# Altium project BW1097_R2M2E3.PrjPcb (part 4 of 10)

## Sheet BW1097_HUB.SchDoc: =project_title
size Tabloid; PageSetup: Record=PageOptions|CenterHorizontal=True|CenterVertical=True|PrintScale=0.73|XCorrection=1.00|YCorrection=1.00|PrintKind=0|BorderSize=5000000|LeftOffset=0|BottomOffset=0|Orientation=2|PaperLength=1000|PaperWidth=1000|Scale=100|PaperSource=7|PrintQuality=-4|MediaType=1|DitherType=10|PaperKind=A4|PrintScaleMode=1; CompanyName: Luxonis Holding; DrawnBy: Brian Weinstein; Organization: Luxonis Holding; Address1: 1925 Harmony Park Drive; Address2: Westminster, CO; Address3: 80234; Address4: United States; DocumentNumber: D0000196; Revision: R2M2E3; SheetNumber: 8; SheetTotal: 17
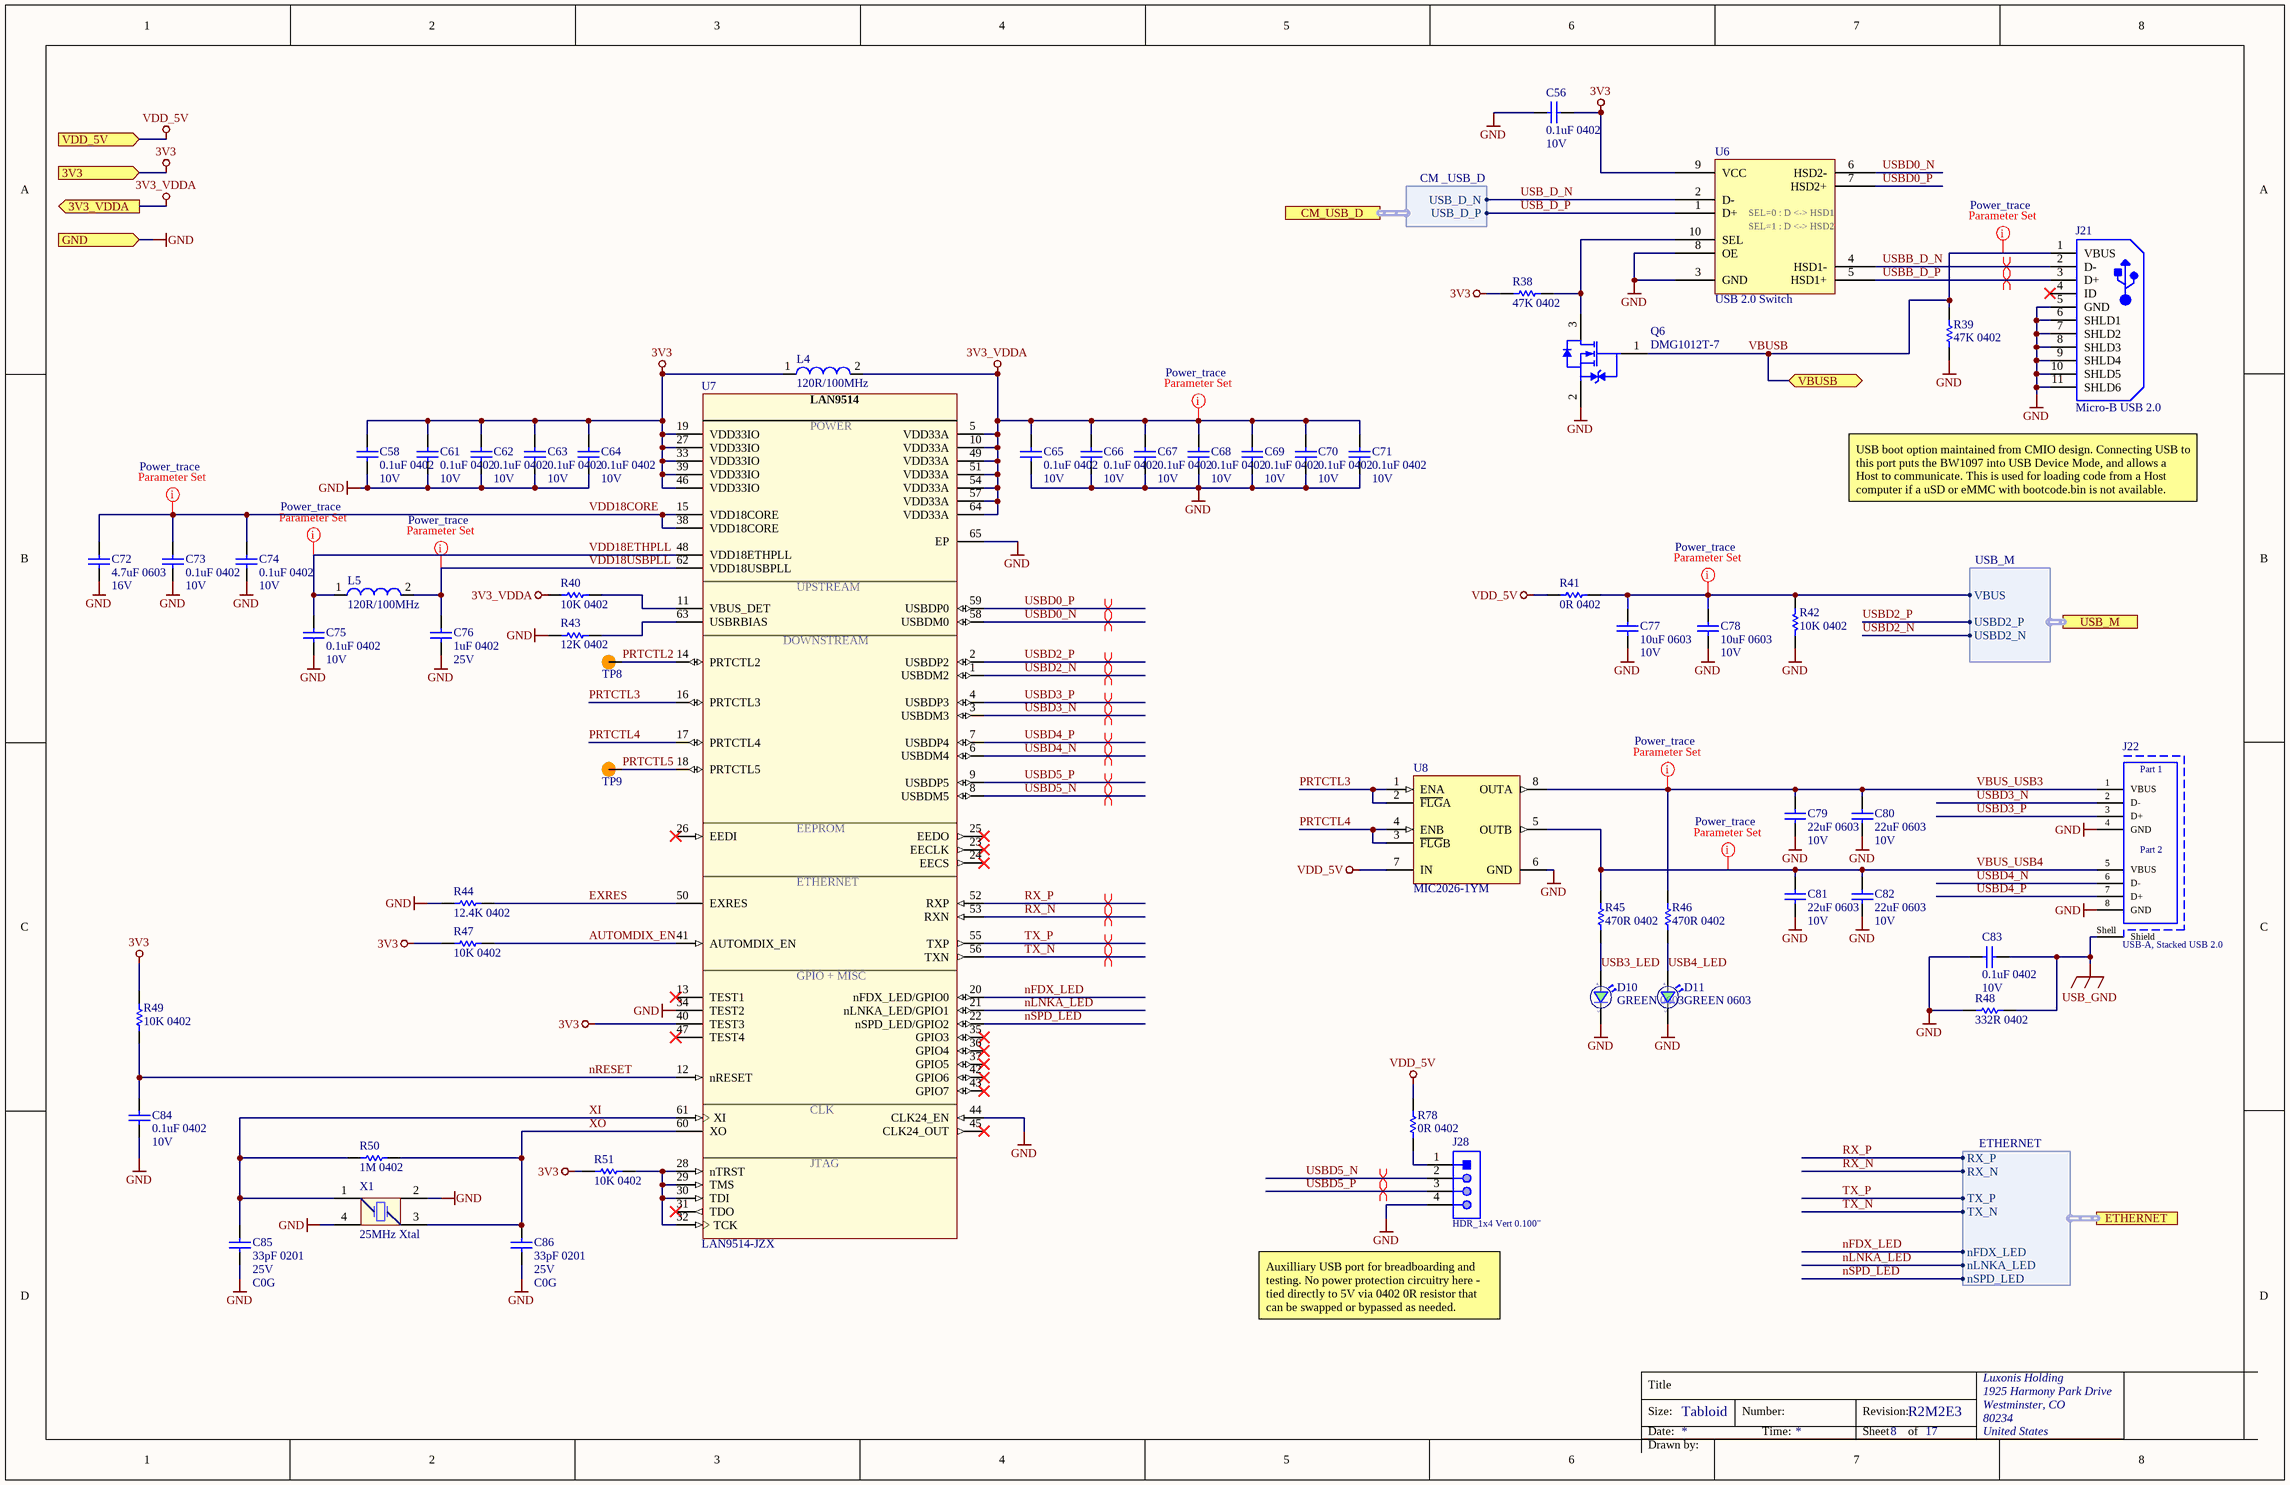
[diagram p6: BW1097_HUB.SchDoc]

### Parts
C56  0.1uF 0402  Voltage Rating: 10V  [CAPC0402(1005)70_N]
C58  0.1uF 0402  Voltage Rating: 10V  [CAPC0402(1005)70_N]
C61  0.1uF 0402  Voltage Rating: 10V  [CAPC0402(1005)70_N]
C62  0.1uF 0402  Voltage Rating: 10V  [CAPC0402(1005)70_N]
C63  0.1uF 0402  Voltage Rating: 10V  [CAPC0402(1005)70_N]
C64  0.1uF 0402  Voltage Rating: 10V  [CAPC0402(1005)70_N]
C65  0.1uF 0402  Voltage Rating: 10V  [CAPC0402(1005)70_N]
C66  0.1uF 0402  Voltage Rating: 10V  [CAPC0402(1005)70_N]
C67  0.1uF 0402  Voltage Rating: 10V  [CAPC0402(1005)70_N]
C68  0.1uF 0402  Voltage Rating: 10V  [CAPC0402(1005)70_N]
C69  0.1uF 0402  Voltage Rating: 10V  [CAPC0402(1005)70_N]
C70  0.1uF 0402  Voltage Rating: 10V  [CAPC0402(1005)70_N]
C71  0.1uF 0402  Voltage Rating: 10V  [CAPC0402(1005)70_N]
C72  4.7uF 0603  Voltage Rating: 16V  [CAPC0603(1608)100_N]
C73  0.1uF 0402  Voltage Rating: 10V  [CAPC0402(1005)70_N]
C74  0.1uF 0402  Voltage Rating: 10V  [CAPC0402(1005)70_N]
C75  0.1uF 0402  Voltage Rating: 10V  [CAPC0402(1005)70_N]
C76  1uF 0402  Voltage Rating: 25V  [CAPC0402(1005)70_N]
C77  10uF 0603  Voltage Rating: 10V  [CAPC0603(1608)100_N]
C78  10uF 0603  Voltage Rating: 10V  [CAPC0603(1608)100_N]
C79  22uF 0603  Voltage Rating: 10V  [CAPC0603(1608)100_N]
C80  22uF 0603  Voltage Rating: 10V  [CAPC0603(1608)100_N]
C81  22uF 0603  Voltage Rating: 10V  [CAPC0603(1608)100_N]
C82  22uF 0603  Voltage Rating: 10V  [CAPC0603(1608)100_N]
C83  0.1uF 0402  Voltage Rating: 10V  [CAPC0402(1005)70_N]
C84  0.1uF 0402  Voltage Rating: 10V  [CAPC0402(1005)70_N]
C85  33pF 0201  Voltage Rating: 25V  Dielectric: C0G  [CAPC0201(0603)33_L]
C86  33pF 0201  Voltage Rating: 25V  Dielectric: C0G  [CAPC0201(0603)33_L]
D10  GREEN 0603  [SML_D1xx8W]
D11  GREEN 0603  [SML_D1xx8W]
J21  Micro-B USB 2.0  [10118194-0001LF]
J22  USB-A, Stacked USB 2.0  [61400826021]
J28  HDR_1x4 Vert 0.100"  [61300411121]
L4  120R/100MHz  [BLM18PG121SN1D_N]
L5  120R/100MHz  [BLM18PG121SN1D_N]
Q6  DMG1012T-7  [DMG1012T-7]
R38  47K 0402  [RESC0402(1005)_N]
R39  47K 0402  [RESC0402(1005)_N]
R40  10K 0402  [RESC0402(1005)_N]
R41  0R 0402  [RESC0402(1005)_N]
R42  10K 0402  [RESC0402(1005)_N]
R43  12K 0402  [RESC0402(1005)_N]
R44  12.4K 0402  [RESC0402(1005)_N]
R45  470R 0402  [RESC0402(1005)_N]
R46  470R 0402  [RESC0402(1005)_N]
R47  10K 0402  [RESC0402(1005)_N]
R48  332R 0402  [RESC0402(1005)_N]
R49  10K 0402  [RESC0402(1005)_N]
R50  1M 0402  [RESC0402(1005)_N]
R51  10K 0402  [RESC0402(1005)_N]
R78  0R 0402  [RESC0402(1005)_N]
TP8  TP100_200_NS  [TP100_200_NS]  (value not drawn)  (no BOM)
TP9  TP100_200_NS  [TP100_200_NS]  (value not drawn)  (no BOM)
U6  USB 2.0 Switch  [FSUSB42UMX]
U7  LAN9514-JZX  [LAN951x-JZX]
U8  MIC2026-1YM  [MIC2026-1YM]
X1  25MHz Xtal  [8Z-25.000MAAJ-T]

### Ports
3V3 (in), 3V3_VDDA (out), CM_USB_D (harness CM _USB_D), ETHERNET (harness ETHERNET), GND (in), USB_M (harness USB_M), VBUSB (bidir), VDD_5V (in)

### Harnesses
CM _USB_D: USB_D_P, USB_D_N
USB_M: USBD2_P, USBD2_N, VBUS
ETHERNET: RX_P, RX_N, TX_P, TX_N, nFDX_LED, nLNKA_LED, nSPD_LED

### Nets
3V3: C56.1 C58.2 C61.2 C62.2 C63.2 C64.2 L4.1 R38.1 R47.1 R49.1 R51.1 U6.9(VCC) U7.19(VDD33IO) U7.27(VDD33IO) U7.33(VDD33IO) U7.39(VDD33IO) U7.40(TEST3) U7.46(VDD33IO) ; port 3V3
3V3_VDDA: C65.2 C66.2 C67.2 C68.2 C69.2 C70.2 C71.2 L4.2 R40.1 U7.5(VDD33A) U7.10(VDD33A) U7.49(VDD33A) U7.51(VDD33A) U7.54(VDD33A) U7.57(VDD33A) U7.64(VDD33A) ; port 3V3_VDDA
GND: C56.2 C58.1 C61.1 C62.1 C63.1 C64.1 C65.1 C66.1 C67.1 C68.1 C69.1 C70.1 C71.1 C72.1 C73.1 C74.1 C75.1 C76.1 C77.1 C78.1 C79.2 C80.2 C81.2 C82.2 C83.1 C84.1 C85.1 C86.1 D10.1(C) D11.1(C) J21.5(GND) J21.6(SHLD1) J21.7(SHLD2) J21.8(SHLD3) J21.9(SHLD4) J21.10(SHLD5) J21.11(SHLD6) J22.4(GND) J22.8(GND) J28.4 Q6.2 R39.1 R42.1 R43.1 R44.1 R48.1 U6.3(GND) U6.8(OE) U7.34(TEST2) U7.44(CLK24_EN) U7.65(EP) U8.6(GND) X1.2 X1.4 ; port GND
USB_GND: C83.2 J22.Shell(Shield) R48.2
VBUS: C77.2 C78.2 R41.1 R42.2 ; port USB_M.VBUS
VBUSB: J21.1(VBUS) Q6.1 R39.2 ; port VBUSB
VDD_5V: R41.2 R78.2 U8.7(IN) ; port VDD_5V
AUTOMDIX_EN: R47.2 U7.41(AUTOMDIX_EN)
EXRES: R44.2 U7.50(EXRES)
nFDX_LED: U7.20(nFDX_LED/GPIO0) ; port ETHERNET.nFDX_LED
nLNKA_LED: U7.21(nLNKA_LED/GPIO1) ; port ETHERNET.nLNKA_LED
nRESET: C84.2 R49.2 U7.12(nRESET)
nSPD_LED: U7.22(nSPD_LED/GPIO2) ; port ETHERNET.nSPD_LED
PRTCTL2: TP8.1 U7.14(PRTCTL2)
PRTCTL3: U7.16(PRTCTL3) U8.1(ENA) U8.2(~{FLG}A)
PRTCTL4: U7.17(PRTCTL4) U8.3(~{FLG}B) U8.4(ENB)
PRTCTL5: TP9.1 U7.18(PRTCTL5)
RX_N: U7.53(RXN) ; port ETHERNET.RX_N
RX_P: U7.52(RXP) ; port ETHERNET.RX_P
TX_N: U7.56(TXN) ; port ETHERNET.TX_N
TX_P: U7.55(TXP) ; port ETHERNET.TX_P
USB3_LED: D10.2(A) R45.1
USB4_LED: D11.2(A) R46.1
USB_D_N: U6.2(D-) ; port CM_USB_D.USB_D_N
USB_D_P: U6.1(D+) ; port CM_USB_D.USB_D_P
USBB_D_N: J21.2(D-) U6.4(HSD1-)
USBB_D_P: J21.3(D+) U6.5(HSD1+)
USBD0_N: U6.6(HSD2-) U7.58(USBDM0)
USBD0_P: U6.7(HSD2+) U7.59(USBDP0)
USBD2_N: U7.1(USBDM2) ; port USB_M.USBD2_N
USBD2_P: U7.2(USBDP2) ; port USB_M.USBD2_P
USBD3_N: J22.2(D-) U7.3(USBDM3)
USBD3_P: J22.3(D+) U7.4(USBDP3)
USBD4_N: J22.6(D-) U7.6(USBDM4)
USBD4_P: J22.7(D+) U7.7(USBDP4)
USBD5_N: J28.2 U7.8(USBDM5)
USBD5_P: J28.3 U7.9(USBDP5)
VBUS_USB3: C79.1 C80.1 J22.1(VBUS) R46.2 U8.8(OUTA)
VBUS_USB4: C81.1 C82.1 J22.5(VBUS) R45.2 U8.5(OUTB)
VDD18CORE: C72.2 C73.2 C74.2 U7.15(VDD18CORE) U7.38(VDD18CORE)
VDD18ETHPLL: C75.2 L5.1 U7.48(VDD18ETHPLL)
VDD18USBPLL: C76.2 L5.2 U7.62(VDD18USBPLL)
XI: C85.2 R50.1 U7.61(XI) X1.1(OSC1)
XO: C86.2 R50.2 U7.60(XO) X1.3(OSC3)
NetJ28_1: J28.1 R78.1
NetQ6_3: Q6.3 R38.2 U6.10(SEL)
NetR40_2: R40.2 U7.11(VBUS_DET)
NetR43_2: R43.2 U7.63(USBRBIAS)
NetR51_2: R51.2 U7.28(nTRST) U7.29(TMS) U7.30(TDI) U7.32(TCK)

Not connected (* = marked no-connect by the designer): J21 4(ID)*; U7 13(TEST1)* 23(EECLK)* 24(EECS)* 25(EEDO)* 26(EEDI)* 31(TDO)* 35(GPIO3)* 36(GPIO4)* 37(GPIO5)* 42(GPIO6)* 43(GPIO7)* 45(CLK24_OUT)* 47(TEST4)*

### Layout directives
differential pair; differential pair class 90ohm: USBB_D_N, USBB_D_P, USBD0_N, USBD0_P, USBD2_N, USBD2_P, USBD3_N, USBD3_P, USBD4_N, USBD4_P, USBD5_N, USBD5_P
differential pair; differential pair class 100ohm: RX_N, RX_P, TX_N, TX_P
net class Power_trace: 3V3_VDDA, VBUS, VBUS_USB3, VBUS_USB4, VBUSB, VDD18CORE, VDD18ETHPLL, VDD18USBPLL

### Notes on the sheet
- (near J21) USB boot option maintained from CMIO design. Connecting USB to this port puts the BW1097 into USB Device Mode, and allows a Host to communicate. This is used for loading code from a Host computer if a uSD or eMMC with bootcode.bin is not available.
- (near J28) Auxilliary USB port for breadboarding and testing. No power protection circuitry here - tied directly to 5V via 0402 0R resistor that can be swapped or bypassed as needed.
- Title
- Size:
- Date:
- Tabloid
- Number:
- Time:
- Revision:
- Sheet
- of
- Drawn by:
- (in symbol 61400826021) Part 1; Part 2
- (in symbol FSUSB42UMX) SEL=0 : D <-> HSD1; SEL=1 : D <-> HSD2
- (in symbol LAN9514-JZX) LAN9514; POWER; UPSTREAM; DOWNSTREAM; EEPROM; ETHERNET; GPIO + MISC; CLK; JTAG